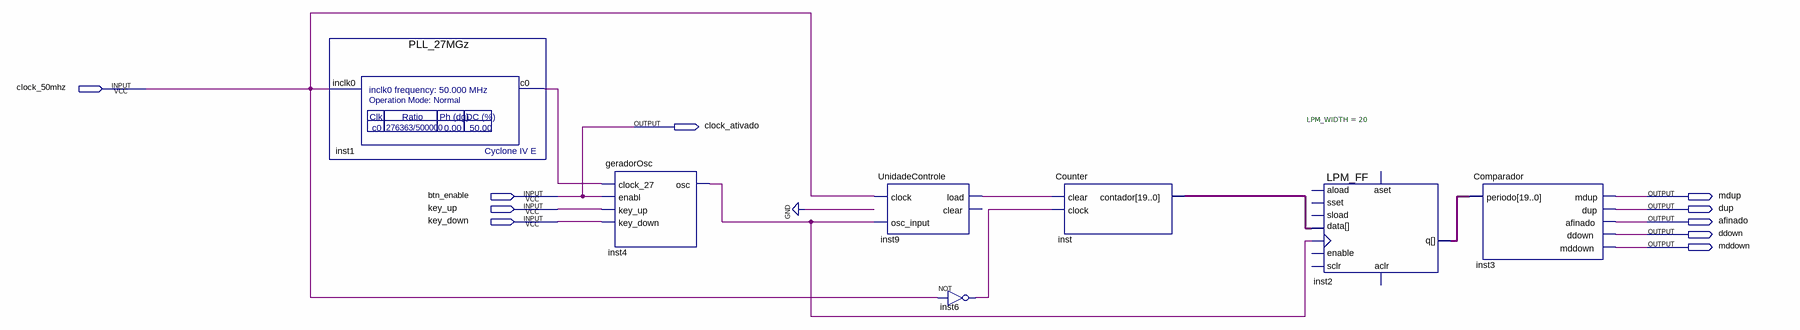
[diagram p0: schematic sheet]
// Quartus schematic Afinador_Violao.bdf as structural Verilog: 7 symbols, 10 pins
module Afinador_Violao (
  input  clock_50mhz,
  input  btn_enable,
  input  key_up,
  input  key_down,
  output clock_ativado,
  output mdup,
  output dup,
  output afinado,
  output ddown,
  output mddown
);

  wire inst1_c0, inst4_osc, inst6_out, inst9_load;
  wire [19:0] inst2_q, inst_contador;

  PLL_27MGz inst1 (.inclk0(clock_50mhz), .c0(inst1_c0));
  geradorOsc inst4 (.clock_27(inst1_c0), .enabl(btn_enable), .key_up(key_up), .key_down(key_down), .osc(inst4_osc));
  UnidadeControle inst9 (.clock(clock_50mhz), .osc_input(inst4_osc), .load(inst9_load));  // open: clear
  not inst6 (inst6_out, clock_50mhz);
  Counter inst (.clear(inst9_load), .clock(inst6_out), .contador(inst_contador));
  LPM_FF #(.LPM_WIDTH(20)) inst2 (
    .clock(inst4_osc), .data(inst_contador), .q(inst2_q));  // open: enable, aload, sset, sload, aset, sclr, aclr
  Comparador inst3 (.periodo(inst2_q), .mdup(mdup), .dup(dup), .afinado(afinado), .ddown(ddown), .mddown(mddown));

  assign clock_ativado = btn_enable;
endmodule
